# Altium schematic sheet Revision History.SchDoc: Revision History
size Letter; Author: Alfredo Cortellini; Organization: IT Logic; Address1: 5753 Highway 85 N; Address2: Crestview, FL 32536; Address3: United States; DocumentNumber: 2; SheetNumber: 2; SheetTotal: 6; Email: pcb-design@itlogic.cloud
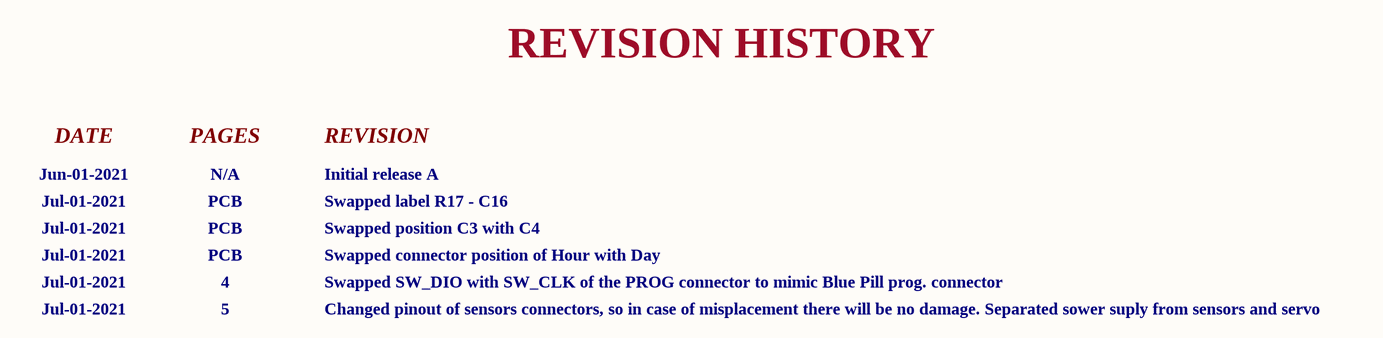
[diagram p0: Revision History.SchDoc]

## Notes on the sheet
- REVISION HISTORY
- Jun-01-2021
- DATE
- N/A
- PAGES
- Initial release A
- REVISION
- Jul-01-2021
- PCB
- Swapped label R17 - C16
- Swapped position C3 with C4
- 4
- 5
- Swapped connector position of Hour with Day
- Swapped SW_DIO with SW_CLK of the PROG connector to mimic Blue Pill prog. connector
- Changed pinout of sensors connectors, so in case of misplacement there will be no damage. Separated sower suply from sensors and servo
- Project:
- Revision:
- Title:
- Sheet:
- of
- Author:
- Date:
- License:
- CC BY-NC-SA 4.0 <https://creativecommons.org/licenses/by-nc-sa/4.0/>